# EAGLE design WiFly_Shield (EAGLE 5.11)
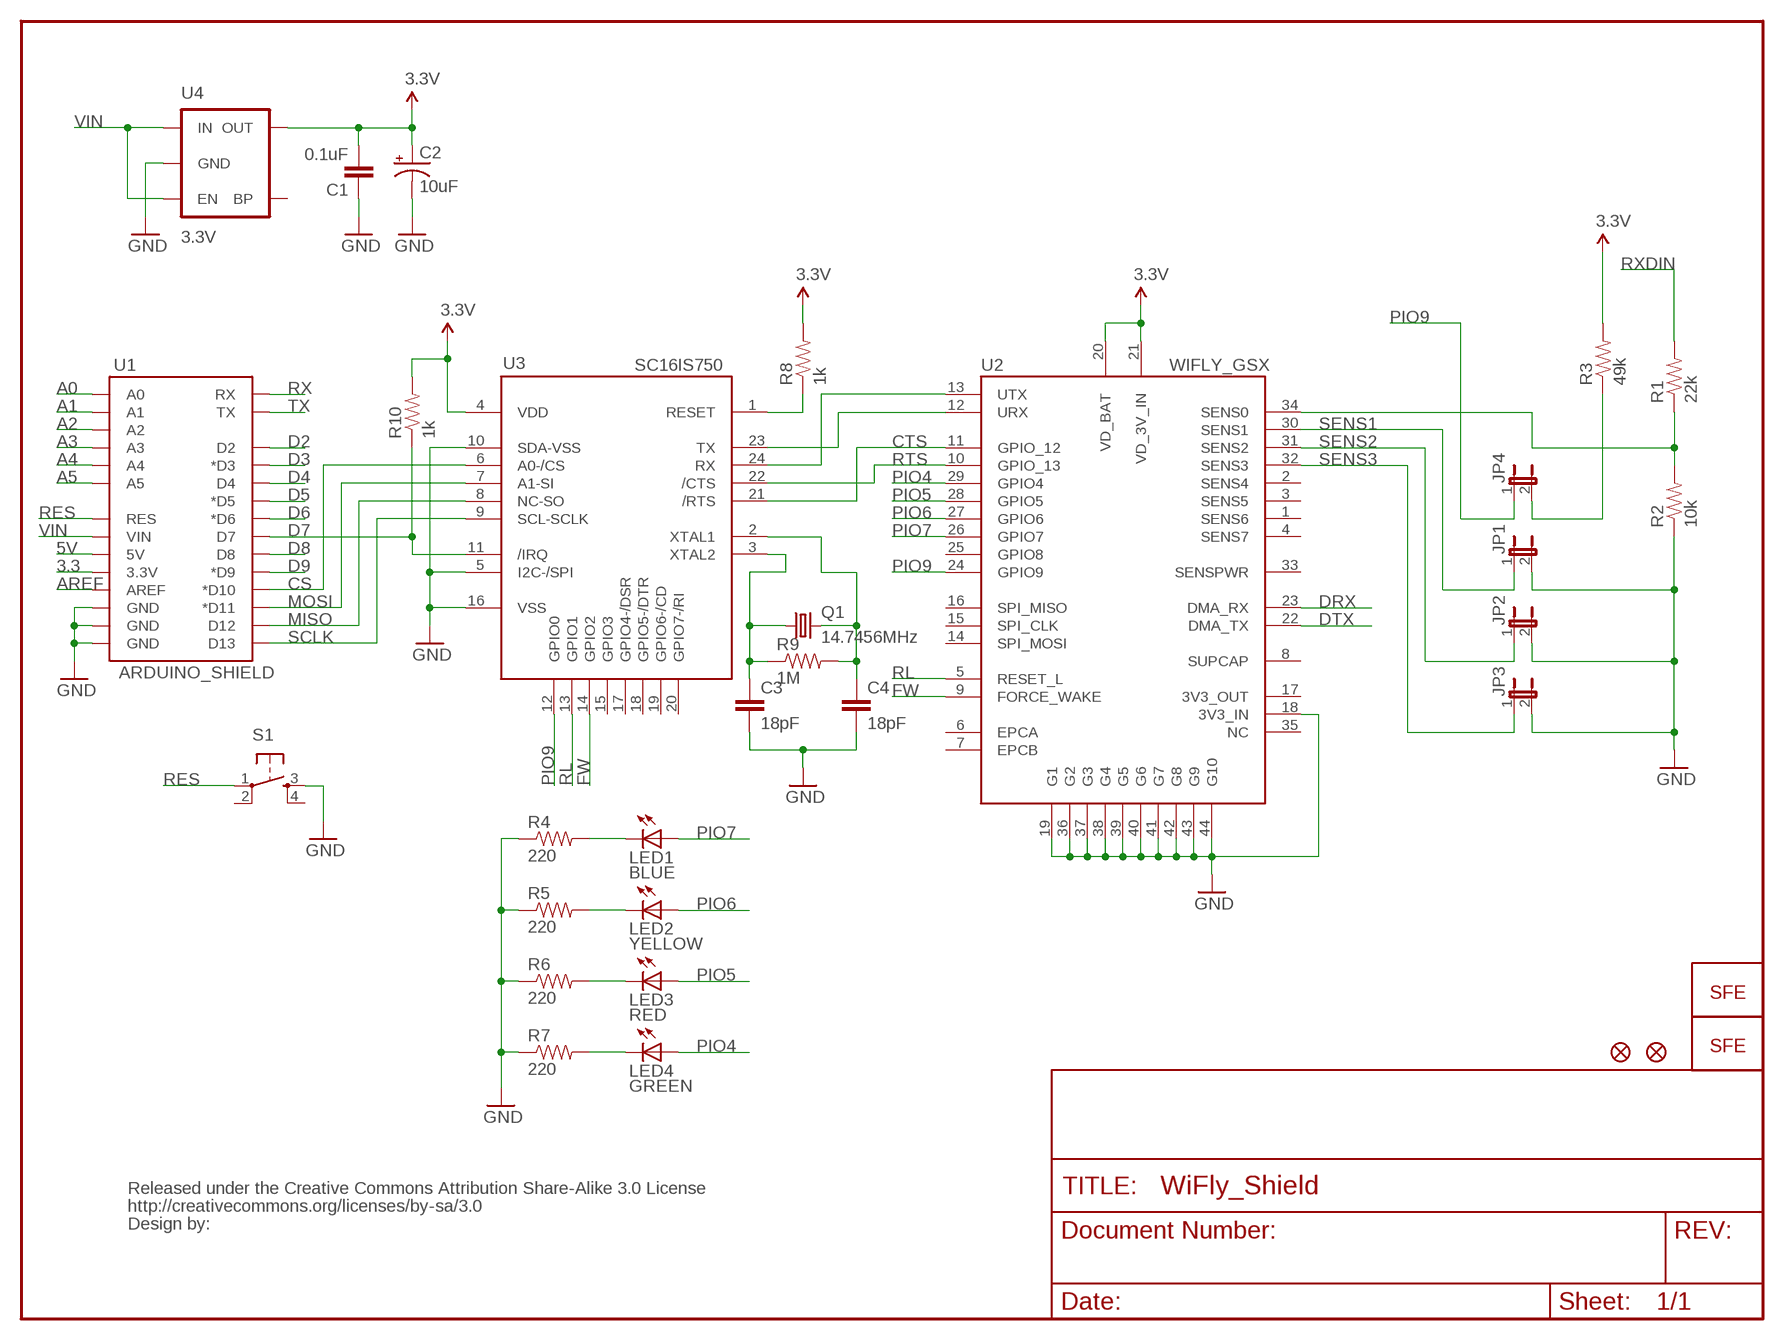
[diagram p0: schematic, sheet 1]

## Parts
C1  0.1uF  CAP0402-CAP  [0402-CAP]
C2  10uF  CAP_POL1206  [EIA3216]
C3  18pF  CAP0402-CAP  [0402-CAP]
C4  18pF  CAP0402-CAP  [0402-CAP]
JP1  JUMPER-2SMD-NO  [SJ_2S-NO]
JP2  JUMPER-2SMD-NO  [SJ_2S-NO]
JP3  JUMPER-2SMD-NO  [SJ_2S-NO]
JP4  JUMPER-2SMD-NO  [SJ_2S-NO]
JP6  LOGO-SFENEW  [SFE-NEW-WEBLOGO]
JP7  FIDUCIAL1X2  [FIDUCIAL-1X2]
JP8  FIDUCIAL1X2  [FIDUCIAL-1X2]
JP9  LOGO-SFESK  [SFE-LOGO-FLAME]
LED1  BLUE  LED0603  [LED-0603]
LED2  YELLOW  LED0603  [LED-0603]
LED3  RED  LED0603  [LED-0603]
LED4  GREEN  LED0603  [LED-0603]
Q1  14.7456MHz  CRYSTAL5X3  [CRYSTAL-SMD-5X3]
R1  22k  RESISTOR0402-RES  [0402-RES]
R2  10k  RESISTOR0402-RES  [0402-RES]
R3  49k  RESISTOR0402-RES  [0402-RES]
R4  220  RESISTOR0402-RES  [0402-RES]
R5  220  RESISTOR0402-RES  [0402-RES]
R6  220  RESISTOR0402-RES  [0402-RES]
R7  220  RESISTOR0402-RES  [0402-RES]
R8  1k  RESISTOR0402-RES  [0402-RES]
R9  1M  RESISTOR0402-RES  [0402-RES]
R10  1k  RESISTOR0402-RES  [0402-RES]
S1  TAC_SWITCHSMD  [TACTILE_SWITCH_SMD]
U1  ARDUINO_SHIELD  ARDUINO_SHIELDLABEL  [DUEMILANOVE_SHIELD]
U2  WIFLY_GSX  [WIFLY_GSX]
U3  SC16IS750  [QFN-24]
U4  3.3V  V_REG_LDOSMD  [SOT23-5]
U$1  CREATIVE_COMMONS  [CREATIVE_COMMONS]

## Nets
3.3: U1.3.3V
3.3V: C1.2 C2.A(+) R3.2 R8.2 R10.2 U2.20(VD_BAT) U2.21(VD_3V_IN) U3.4(VDD) U4.5(OUT)
5V: U1.5V
A0: U1.A0
A1: U1.A1
A2: U1.A2
A3: U1.A3
A4: U1.A4
A5: U1.A5
AREF: U1.AREF
CS: U1.D10(*D10) U3.6(A0-/CS)
CTS: U2.11(GPIO_12) U3.21(/RTS)
D2: U1.D2
D3: U1.D3(*D3)
D4: U1.D4
D5: U1.D5(*D5)
D6: U1.D6(*D6)
D7: R10.1 U1.D7 U3.11(/IRQ)
D8: U1.D8
D9: U1.D9(*D9)
DRX: U2.23(DMA_RX)
DTX: U2.22(DMA_TX)
FW: U2.9(FORCE_WAKE) U3.14(GPIO2)
GND: C1.1 C2.C(-) C3.2 C4.2 JP1.2 JP2.2 JP3.2 R2.1 R4.1 R5.1 R6.1 R7.1 S1.3 U1.GND@0(GND) U1.GND@1(GND) U1.GND@2(GND) U2.18(3V3_IN) U2.19(G1) U2.36(G2) U2.37(G3) U2.38(G4) U2.39(G5) U2.40(G6) U2.41(G7) U2.42(G8) U2.43(G9) U2.44(G10) U3.5(I2C-/SPI) U3.10(SDA-VSS) U3.16(VSS) U4.2(GND)
MISO: U1.D12 U3.8(NC-SO)
MOSI: U1.D11(*D11) U3.7(A1-SI)
N$1: LED4.C R7.2
N$2: JP4.2 R3.1
N$3: LED3.C R6.2
N$4: LED2.C R5.2
N$5: LED1.C R4.2
N$6: U2.13(UTX) U3.24(RX)
N$7: U2.12(URX) U3.23(TX)
N$9: R8.1 U3.1(RESET)
N$11: C3.1 Q1.1 R9.1 U3.3(XTAL2)
N$12: C4.1 Q1.3 R9.2 U3.2(XTAL1)
N$16: R1.1 R2.2 U2.34(SENS0)
PIO4: LED4.A U2.29(GPIO4)
PIO5: LED3.A U2.28(GPIO5)
PIO6: LED2.A U2.27(GPIO6)
PIO7: LED1.A U2.26(GPIO7)
PIO9: JP4.1 U2.24(GPIO9) U3.12(GPIO0)
RES: S1.1 U1.RES
RL: U2.5(RESET_L) U3.13(GPIO1)
RTS: U2.10(GPIO_13) U3.22(/CTS)
RX: U1.RX
RXDIN: R1.2
SCLK: U1.D13 U3.9(SCL-SCLK)
SENS1: JP1.1 U2.30(SENS1)
SENS2: JP2.1 U2.31(SENS2)
SENS3: JP3.1 U2.32(SENS3)
TX: U1.TX
VIN: U1.VIN U4.1(IN) U4.3(EN)
Unconnected: S1.2 S1.4 U2.1(SENS6) U2.2(SENS4) U2.3(SENS5) U2.4(SENS7) U2.6(EPCA) U2.7(EPCB) U2.8(SUPCAP) U2.14(SPI_MOSI) U2.15(SPI_CLK) U2.16(SPI_MISO) U2.17(3V3_OUT) U2.25(GPIO8) U2.33(SENSPWR) U2.35(NC) U3.15(GPIO3) U3.17(GPIO4-/DSR) U3.18(GPIO5-/DTR) U3.19(GPIO6-/CD) U3.20(GPIO7-/RI) U4.4(BP)

## Library data of the parts
C1 C3 C4 = SparkFun:CAP: Capacitor Standard 0603 ceramic capacitor, and 0.1" leaded capacitor.
C2 = SparkFun:CAP_POL: Capacitor Polarized These are standard SMD and PTH capacitors. Normally 10uF, 47uF, and 100uF in electrolytic and tantalum varieties. Always verify the external diameter of the through hole cap, it varies with capacity, voltage, and manufacturer. The EIA devices should be standard.
JP1-JP4 = SparkFun:JUMPER-2: Jumper Basic 0.1" spaced jumper. Use with breakaway headers.
JP6 JP9 = SparkFun:LOGO-SFE: Spark Fun Electronics PCB Logo This is the standard Spark Fun Electronics PCB logo.
JP7 JP8 = SparkFun:FIDUCIAL: Fiducial Alignment Points Various fiducial points for machine vision alignment.
LED1-LED4 = SparkFun:LED: LEDs Standard schematic elements and footprints for 5mm, 3mm, 1206, and 0603 sized LEDs. 5mm - Spark Fun Electronics SKU : COM-00529 (and others)
Q1 = SparkFun:CRYSTAL: Crystals Various standard crystals. Proven footprints. Spark Fun Electronics SKU : COM-00534
R1-R10 = SparkFun:RESISTOR: Resistor Basic schematic elements and footprints for 0603, 1206, and PTH 1/10th watt (small) resistors.
S1 = SparkFun:TAC_SWITCH: Momentary Switch Button commonly used for reset or general input. Spark Fun Electronics SKU : COM-00097
U1 = SparkFun:ARDUINO_SHIELD
U2 = SparkFun:WIFLY_GSX
U3 = SparkFun:SC16IS750
U4 = SparkFun:V_REG_LDO: Voltage Regulator LDO Standard 150mA LDO voltage regulator in SOT-23 layout. Micrel part MIC5205. BP (by-pass) pin is used to lower output noise with 470pF cap.
U$1 = SparkFun:CREATIVE_COMMONS

## Board
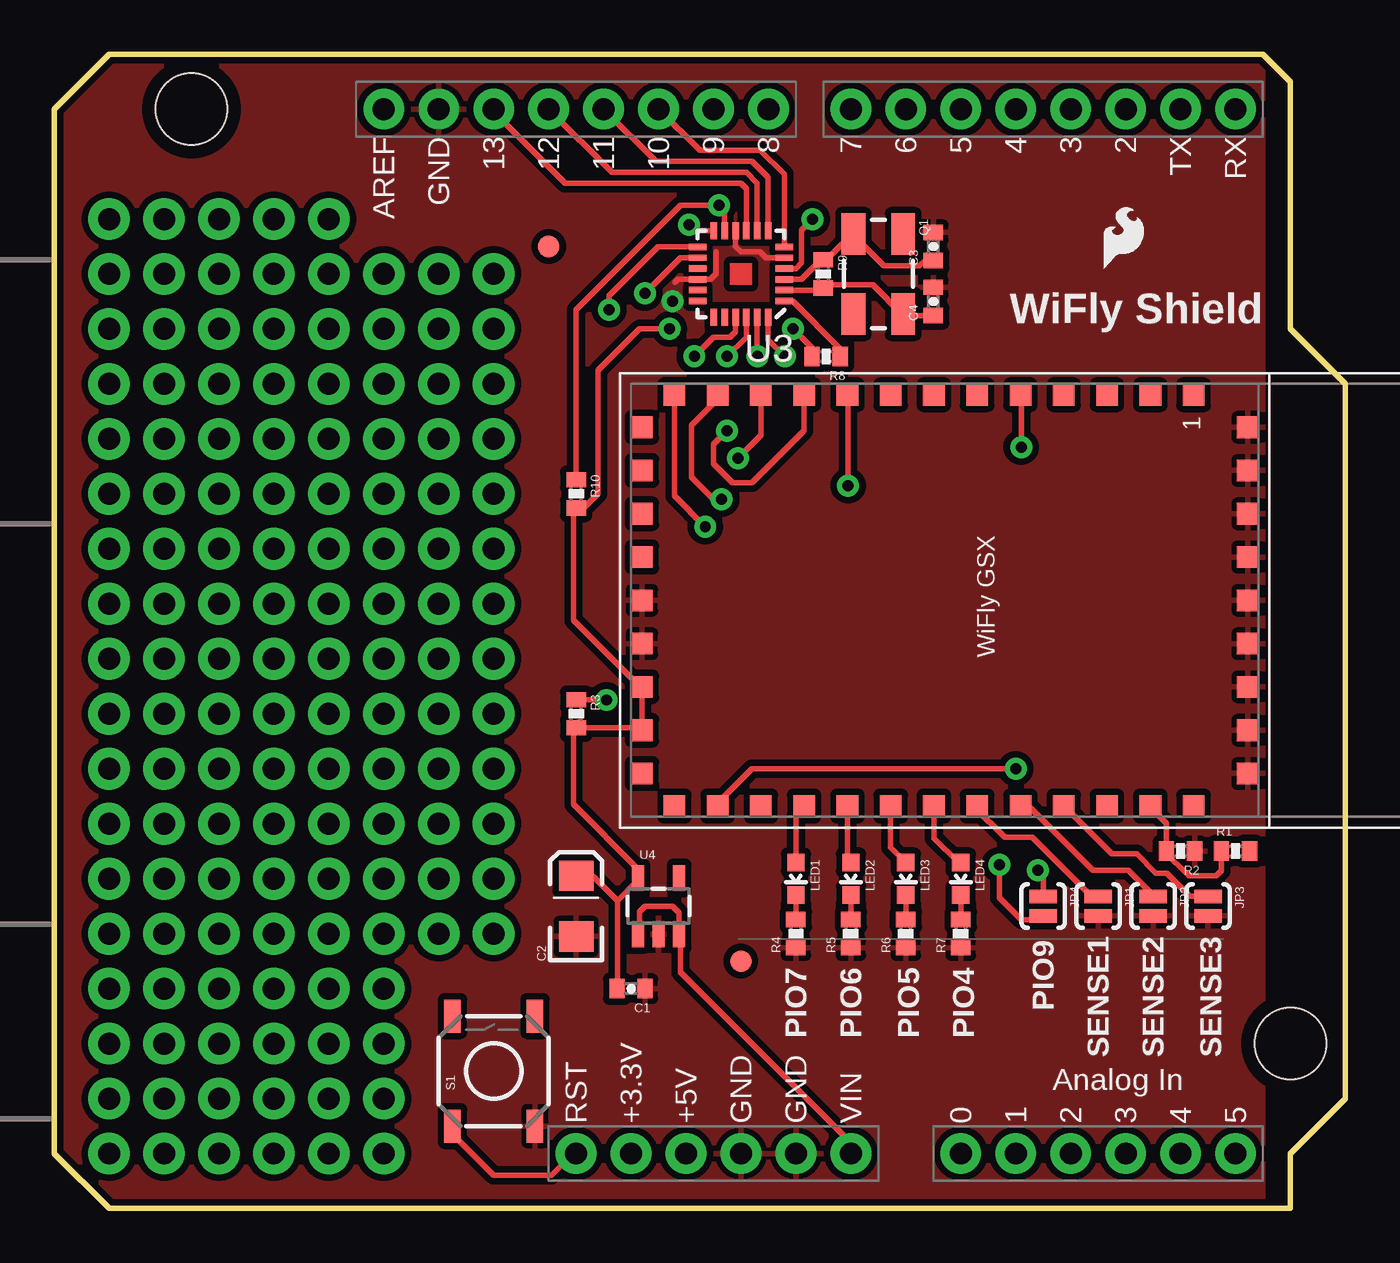
[diagram p1: board, top side]
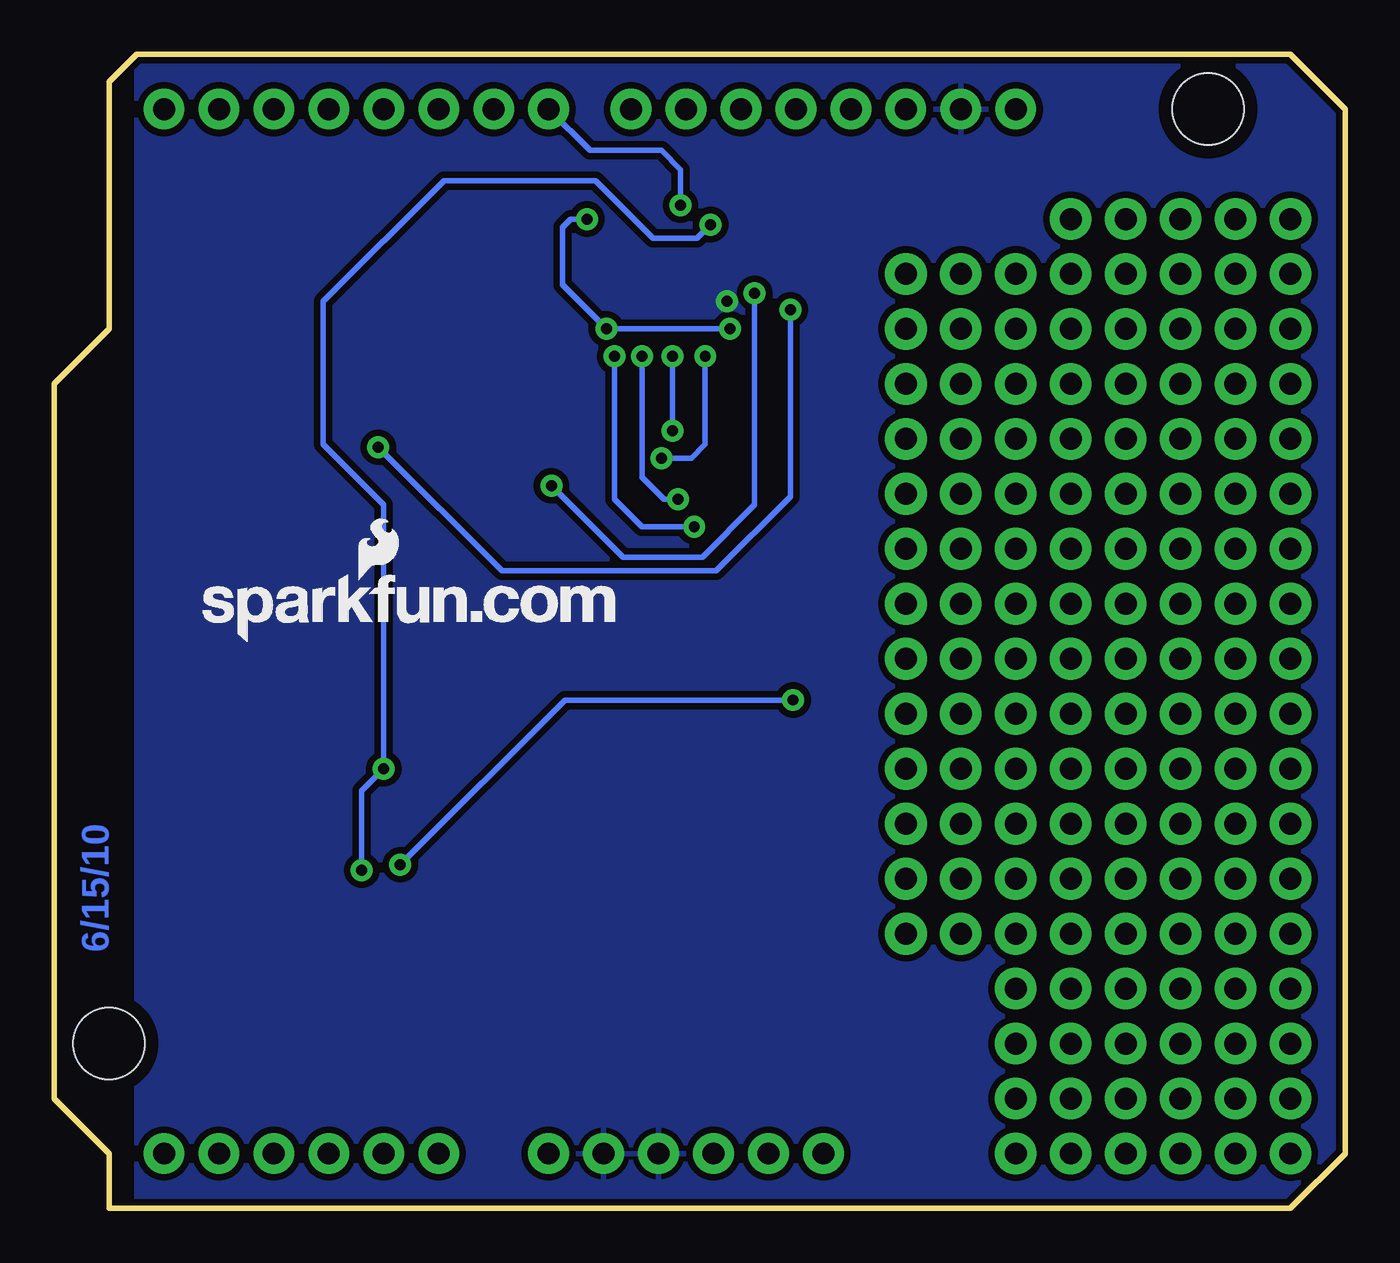
[diagram p2: board, bottom side, seen from below]

Size 59.69 x 53.34 mm. Coordinates in mm from the lower left corner, seen from the top.
Outline: 2.54,53.34 55.88,53.34 57.15,52.07 57.15,40.64 59.69,38.1 59.69,5.08 57.15,2.54 57.15,0 2.54,0 0,2.54 0,50.8 2.54,53.34
Copper layers (1*16): Top 0.035mm / dielectric 1.5mm / Bottom 0.035mm
Design rules "SparkFun *": minimum track width 8mil, minimum drill 20mil, track to track 8mil, track to pad 8mil, pad to pad 7mil, via to via 8mil, smd to smd 8mil, copper to edge 10mil, drill to drill 8mil, minimum pad ring 12mil, minimum via ring 10mil, stop-mask expansion 4mil, vias tented up to drill 25mil, thermal gap 10mil

### Footprints (pad centres in the part's own frame; a part is rotated, then mirrored left to right if it is on the bottom)
0402-CAP = smd 0.7 x 0.9: 1 -0.65,0; 2 0.65,0
EIA3216 = smd 1.4 x 1.6: A 1.4,0; C -1.4,0
SJ_2S-NO = smd 0.635 x 1.27: 1 -0.45,0; 2 0.45,0
FIDUCIAL-1X2 = smd 1 x 1: 1 0,0
LED-0603 = smd 0.8 x 0.8: A 0,-0.75; C 0,0.75
CRYSTAL-SMD-5X3 = smd 1.9 x 1.1: 1 -1.85,-1.15; 2 1.85,-1.15; 3 1.85,1.15; 4 -1.85,1.15
0402-RES = smd 0.7 x 0.9: 1 -0.65,0; 2 0.65,0
TACTILE_SWITCH_SMD = smd 1.524 x 0.762: 1 -2.54,1.905; 2 2.54,1.905; 3 -2.54,-1.905; 4 2.54,-1.905
DUEMILANOVE_SHIELD = drill 1.016 pad 1.88 round: 3.3V 50.8,26.67; 5V 50.8,29.21; A0 50.8,41.91; A1 50.8,44.45; A2 50.8,46.99; A3 50.8,49.53; A4 50.8,52.07; A5 50.8,54.61; AREF 2.54,15.24; D2 2.54,49.53; D3 2.54,46.99; D4 2.54,44.45; D5 2.54,41.91; D6 2.54,39.37; D7 2.54,36.83; D8 2.54,33.02; D9 2.54,30.48; D10 2.54,27.94; D11 2.54,25.4; D12 2.54,22.86; D13 2.54,20.32; GND@0 50.8,31.75; GND@1 50.8,34.29; GND@2 2.54,17.78; RES 50.8,24.13; RX 2.54,54.61; TX 2.54,52.07; VIN 50.8,36.83 | hole 3.302: 45.72,57.15; 2.54,6.35
WIFLY_GSX = smd 1 x 1: 1 0.5,26; 2 0.5,24; 3 0.5,22; 4 0.5,20; 5 0.5,18; 6 0.5,16; 7 0.5,14; 8 0.5,12; 9 0.5,10; 10 0.5,8; 11 0.5,6; 12 0.5,4; 13 0.5,2; 14 2,0.5; 15 4,0.5; 16 6,0.5; 17 8,0.5; 18 10,0.5; 19 12,0.5; 20 14,0.5; 21 16,0.5; 22 18,0.5; 23 19.5,2; 24 19.5,4; 25 19.5,6; 26 19.5,8; 27 19.5,10; 28 19.5,12; 29 19.5,14; 30 19.5,16; 31 19.5,18; 32 19.5,20; 33 19.5,22; 34 19.5,24; 35 19.5,26; 36 18,28.5; 37 16,28.5; 38 14,28.5; 39 12,28.5; 40 10,28.5; 41 8,28.5; 42 6,28.5; 43 4,28.5; 44 2,28.5
QFN-24 = smd 0.8 x 0.3: 1 -2,1.25; 2 -2,0.75; 3 -2,0.25; 4 -2,-0.25; 5 -2,-0.75; 6 -2,-1.25; 13 2,-1.25; 14 2,-0.75; 15 2,-0.25; 16 2,0.25; 17 2,0.75; 18 2,1.25 | smd 0.3 x 0.8: 7 -1.25,-2; 8 -0.75,-2; 9 -0.25,-2; 10 0.25,-2; 11 0.75,-2; 12 1.25,-2; 19 1.25,2; 20 0.75,2; 21 0.25,2; 22 -0.25,2; 23 -0.75,2; 24 -1.25,2
SOT23-5 = smd 0.55 x 1.2: 1 -0.95,-1.3; 2 0,-1.3; 3 0.95,-1.3; 4 0.95,1.3; 5 -0.95,1.3

### Placement (x,y rotation side)
C1  26.67,10.16 180 top
C2  24.13,13.97 90 top
C3  40.64,44.45 90 top
C4  40.64,41.91 90 top
JP1  48.26,13.97 270 top
JP2  50.8,13.97 270 top
JP3  53.34,13.97 270 top
JP4  45.72,13.97 270 top
JP6  52.83,26.16 0 bottom
JP7  31.75,11.43 0 top
JP8  22.86,44.45 0 top
JP9  48.51,43.43 0 top
LED1  34.29,15.24 180 top
LED2  36.83,15.24 180 top
LED3  39.37,15.24 180 top
LED4  41.91,15.24 180 top
Q1  38.1,43.18 270 top
R1  54.61,16.51 0 top
R2  52.07,16.51 180 top
R3  24.13,22.86 270 top
R4  34.29,12.7 90 top
R5  36.83,12.7 90 top
R6  39.37,12.7 90 top
R7  41.91,12.7 90 top
R8  35.69,39.37 180 top
R9  35.56,43.18 270 top
R10  24.13,33.02 270 top
S1  20.32,6.35 90 top
U1  0,53.34 270 top
U2  26.67,38.1 270 top
U3  31.75,43.18 180 top
U4  27.94,13.97 0 top
U$1  5.08,-8.89 0 top  (outside the outline)

### Tracks (layer width: path | path; a pad name or v marks a point on that pad's centre or on a via)
3.3V  (via drill 0.51)
  Top 0.254: 27.11,22.16 27.07,22.21 24.37,22.21 24.26,22.1 24.14,22.21 R3.2 24.13,22.1 24,22.1 | 27.11,22.16 U2.21 | 24,22.1 24,18.67 26.99,15.68 26.99,15.31 26.95,15.27 | 24,22.1 24,22.23 24.26,22.48 | 27.3,22.1 | 27.3,22.1 U2.21 27.17,22.22 | 27.18,22.23 27.3,22.1 | 27.18,22.23 27.17,22.23 U2.20 27.17,24.12 | v34.16,40.64 35.04,39.77 35.04,39.38 35.05,39.37 R8.2 | v35.05,45.72 34.54,45.21 34.54,43.69 34.29,43.43 33.79,43.43 33.78,43.43 U3.4 | 24.14,32.37 24.13,32.38 24,32.26 24,27.18 27.08,24.1 27.15,24.1 27.17,24.12 | 24.14,32.37 24.5,32.37 25.15,33.02 25.15,38.73 27.05,40.64 v28.45,40.64 | 27.17,24.12 27.18,24.13 | C1.2 26.04,10.18 26.04,14.22 | 26.92,15.24 26.96,15.24 U4.5 26.95,15.27 | 26.04,14.22 26.92,15.11 26.92,15.24 | C2.A 24.89,15.37 26.04,14.22 | 26.92,15.24 26.95,15.27 | 27.11,22.16 27.17,22.22 | 27.17,22.22 27.18,22.23 | R10.2 24.13,32.26 24.14,32.27 24.14,32.37
  Bottom 0.254: v35.05,45.72 35.81,45.72 36.2,45.34 36.2,42.67 v34.16,40.64 v28.45,40.64
CS
  Top 0.254: U1.D10 29.84,48.9 32.64,48.9 33.75,47.78 U3.6
CTS  (via drill 0.51)
  Top 0.254: U3.21 31.5,40.52 31.24,40.26 30.48,40.26 v29.59,39.37 | U2.11 32.67,35.72 v31.62,34.67
  Bottom 0.254: v31.62,34.67 30.23,34.67 29.59,35.31 v29.59,39.37
D7  (via drill 0.51)
  Top 0.254: U3.11 31,46.09 v30.73,46.35 28.96,46.35 24.13,41.53 R10.1
  Bottom 0.254: v30.73,46.35 30.73,48.01 31.62,48.9 34.92,48.9 U1.D7
FW  (via drill 0.51)
  Top 0.254: U3.14 28.94,43.93 v27.3,42.29 | v36.7,33.4 36.7,37.57 U2.9
  Bottom 0.254: v27.3,42.29 27.3,32.51 29.72,30.1 33.4,30.1 v36.7,33.4
GND  (via drill 0.51)
  Top 0.254: 30.61,44.2 30.61,43.18 30.35,42.93 29.84,42.93 U3.16 28.83,42.93 28.7,42.8 | U3.5 32.91,43.93 32.64,44.2 31.75,44.2 31.5,44.45 U3.10
  other vias: 28.57,41.91
  pour Bottom (isolate 0.305): 2.54,53.34 55.88,53.34 55.88,0 2.54,0 0,2.54 0,50.8
  pour Top (isolate 0.305): 2.54,53.34 55.88,53.34 55.88,0 2.54,0 0,2.54 0,50.8
MISO
  Top 0.254: U3.8 32.5,47.38 32,47.88 25.78,47.88 U1.D12
MOSI
  Top 0.254: U3.7 33,47.65 32.26,48.39 27.81,48.39 U1.D11
N$1
  Top 0.254: 41.91,14.61 LED4.C R7.2
N$2  (via drill 0.51)
  Top 0.254: R3.1 25.51,23.51 v25.53,23.5 | v43.69,15.88 43.69,14.35 44.7,13.34 45.47,13.34 45.65,13.52 JP4.2
  Bottom 0.254: v25.53,23.5 36.07,23.5 v43.69,15.88
N$3
  Top 0.254: 39.37,14.61 LED3.C R6.2
N$4
  Top 0.254: 36.83,14.61 LED2.C R5.2
N$5
  Top 0.254: R4.2 LED1.C
N$6  (via drill 0.51)
  Top 0.254: U3.24 33,40.15 v33.78,39.37 | U2.13 28.67,32.92 v30.1,31.5
  Bottom 0.254: v30.1,31.5 32.51,31.5 33.78,32.77 v33.78,39.37
N$7  (via drill 0.51)
  Top 0.254: U3.23 32.5,39.89 v32.51,39.37 | U2.12 30.67,37.4 29.46,36.2 29.46,33.78 30.48,32.77 v30.86,32.77
  Bottom 0.254: v30.86,32.77 31.5,32.77 32.51,33.78 v32.51,39.37
N$9
  Top 0.254: R8.1 36.34,39.74 34.14,41.93 U3.1
N$11
  Top 0.254: C3.1 40.24,43.8 40.01,43.56 38.35,43.56 36.95,44.97 | 36.95,44.97 Q1.1 | 36.95,44.97 36.84,44.97 35.69,43.81 35.67,43.83 R9.1 35.45,43.83 34.55,42.93 U3.3
N$12
  Top 0.254: C4.1 39.38,41.26 39.31,41.33 Q1.3 39.19,41.33 37.85,42.67 35.81,42.67 35.56,42.42 R9.2 35.56,42.55 35.45,42.43 U3.2
N$15  (via drill 1.02 pad 1.93)
  other vias: 5.08,2.54
N$16
  Top 0.254: U2.34 50.67,18.55 51.42,17.8 R2.2 51.31,16.51 52.45,15.37 53.72,15.37 53.96,15.61 R1.1
N$17  (via drill 1.02 pad 1.93)
  other vias: 7.62,2.54
N$18  (via drill 1.02 pad 1.93)
  other vias: 10.16,2.54
N$19  (via drill 1.02 pad 1.93)
  other vias: 12.7,2.54
N$20  (via drill 1.02 pad 1.93)
  other vias: 15.24,2.54
N$23  (via drill 1.02 pad 1.93)
  other vias: 2.54,2.54
N$24  (via drill 1.02 pad 1.93)
  other vias: 5.08,5.08
N$25  (via drill 1.02 pad 1.93)
  other vias: 7.62,5.08
N$26  (via drill 1.02 pad 1.93)
  other vias: 10.16,5.08
N$27  (via drill 1.02 pad 1.93)
  other vias: 12.7,5.08
N$28  (via drill 1.02 pad 1.93)
  other vias: 15.24,5.08
N$31  (via drill 1.02 pad 1.93)
  other vias: 2.54,5.08
N$32  (via drill 1.02 pad 1.93)
  other vias: 5.08,7.62
N$33  (via drill 1.02 pad 1.93)
  other vias: 7.62,7.62
N$34  (via drill 1.02 pad 1.93)
  other vias: 10.16,7.62
N$35  (via drill 1.02 pad 1.93)
  other vias: 12.7,7.62
N$36  (via drill 1.02 pad 1.93)
  other vias: 15.24,7.62
N$39  (via drill 1.02 pad 1.93)
  other vias: 2.54,7.62
N$40  (via drill 1.02 pad 1.93)
  other vias: 5.08,10.16
N$41  (via drill 1.02 pad 1.93)
  other vias: 7.62,10.16
N$42  (via drill 1.02 pad 1.93)
  other vias: 10.16,10.16
N$43  (via drill 1.02 pad 1.93)
  other vias: 12.7,10.16
N$44  (via drill 1.02 pad 1.93)
  other vias: 15.24,10.16
N$47  (via drill 1.02 pad 1.93)
  other vias: 2.54,10.16
N$48  (via drill 1.02 pad 1.93)
  other vias: 5.08,12.7
N$49  (via drill 1.02 pad 1.93)
  other vias: 7.62,12.7
N$50  (via drill 1.02 pad 1.93)
  other vias: 10.16,12.7
N$51  (via drill 1.02 pad 1.93)
  other vias: 12.7,12.7
N$52  (via drill 1.02 pad 1.93)
  other vias: 15.24,12.7
N$53  (via drill 1.02 pad 1.93)
  other vias: 17.78,12.7
N$54  (via drill 1.02 pad 1.93)
  other vias: 20.32,12.7
N$55  (via drill 1.02 pad 1.93)
  other vias: 2.54,12.7
N$56  (via drill 1.02 pad 1.93)
  other vias: 5.08,15.24
N$57  (via drill 1.02 pad 1.93)
  other vias: 7.62,15.24
N$58  (via drill 1.02 pad 1.93)
  other vias: 10.16,15.24
N$59  (via drill 1.02 pad 1.93)
  other vias: 12.7,15.24
N$60  (via drill 1.02 pad 1.93)
  other vias: 15.24,15.24
N$61  (via drill 1.02 pad 1.93)
  other vias: 17.78,15.24
N$62  (via drill 1.02 pad 1.93)
  other vias: 20.32,15.24
N$63  (via drill 1.02 pad 1.93)
  other vias: 2.54,15.24
N$64  (via drill 1.02 pad 1.93)
  other vias: 5.08,17.78
N$65  (via drill 1.02 pad 1.93)
  other vias: 7.62,17.78
N$66  (via drill 1.02 pad 1.93)
  other vias: 10.16,17.78
N$67  (via drill 1.02 pad 1.93)
  other vias: 12.7,17.78
N$68  (via drill 1.02 pad 1.93)
  other vias: 15.24,17.78
N$69  (via drill 1.02 pad 1.93)
  other vias: 17.78,17.78
N$70  (via drill 1.02 pad 1.93)
  other vias: 20.32,17.78
N$71  (via drill 1.02 pad 1.93)
  other vias: 2.54,17.78
N$72  (via drill 1.02 pad 1.93)
  other vias: 5.08,20.32
N$73  (via drill 1.02 pad 1.93)
  other vias: 7.62,20.32
N$74  (via drill 1.02 pad 1.93)
  other vias: 10.16,20.32
N$75  (via drill 1.02 pad 1.93)
  other vias: 12.7,20.32
N$76  (via drill 1.02 pad 1.93)
  other vias: 15.24,20.32
N$77  (via drill 1.02 pad 1.93)
  other vias: 17.78,20.32
N$78  (via drill 1.02 pad 1.93)
  other vias: 20.32,20.32
N$79  (via drill 1.02 pad 1.93)
  other vias: 2.54,20.32
N$80  (via drill 1.02 pad 1.93)
  other vias: 5.08,22.86
N$81  (via drill 1.02 pad 1.93)
  other vias: 7.62,22.86
N$82  (via drill 1.02 pad 1.93)
  other vias: 10.16,22.86
N$83  (via drill 1.02 pad 1.93)
  other vias: 12.7,22.86
N$84  (via drill 1.02 pad 1.93)
  other vias: 15.24,22.86
N$85  (via drill 1.02 pad 1.93)
  other vias: 17.78,22.86
N$86  (via drill 1.02 pad 1.93)
  other vias: 20.32,22.86
N$87  (via drill 1.02 pad 1.93)
  other vias: 2.54,22.86
N$88  (via drill 1.02 pad 1.93)
  other vias: 5.08,25.4
N$89  (via drill 1.02 pad 1.93)
  other vias: 7.62,25.4
N$90  (via drill 1.02 pad 1.93)
  other vias: 10.16,25.4
N$91  (via drill 1.02 pad 1.93)
  other vias: 12.7,25.4
N$92  (via drill 1.02 pad 1.93)
  other vias: 15.24,25.4
N$93  (via drill 1.02 pad 1.93)
  other vias: 17.78,25.4
N$94  (via drill 1.02 pad 1.93)
  other vias: 20.32,25.4
N$95  (via drill 1.02 pad 1.93)
  other vias: 2.54,25.4
N$96  (via drill 1.02 pad 1.93)
  other vias: 5.08,27.94
N$97  (via drill 1.02 pad 1.93)
  other vias: 7.62,27.94
N$98  (via drill 1.02 pad 1.93)
  other vias: 10.16,27.94
N$99  (via drill 1.02 pad 1.93)
  other vias: 12.7,27.94
N$100  (via drill 1.02 pad 1.93)
  other vias: 15.24,27.94
N$101  (via drill 1.02 pad 1.93)
  other vias: 17.78,27.94
N$102  (via drill 1.02 pad 1.93)
  other vias: 20.32,27.94
N$103  (via drill 1.02 pad 1.93)
  other vias: 2.54,27.94
N$104  (via drill 1.02 pad 1.93)
  other vias: 5.08,30.48
N$105  (via drill 1.02 pad 1.93)
  other vias: 7.62,30.48
N$106  (via drill 1.02 pad 1.93)
  other vias: 10.16,30.48
N$107  (via drill 1.02 pad 1.93)
  other vias: 12.7,30.48
N$108  (via drill 1.02 pad 1.93)
  other vias: 15.24,30.48
N$109  (via drill 1.02 pad 1.93)
  other vias: 17.78,30.48
N$110  (via drill 1.02 pad 1.93)
  other vias: 20.32,30.48
N$111  (via drill 1.02 pad 1.93)
  other vias: 2.54,30.48
N$112  (via drill 1.02 pad 1.93)
  other vias: 5.08,33.02
N$113  (via drill 1.02 pad 1.93)
  other vias: 7.62,33.02
N$114  (via drill 1.02 pad 1.93)
  other vias: 10.16,33.02
N$115  (via drill 1.02 pad 1.93)
  other vias: 12.7,33.02
N$116  (via drill 1.02 pad 1.93)
  other vias: 15.24,33.02
N$117  (via drill 1.02 pad 1.93)
  other vias: 17.78,33.02
N$118  (via drill 1.02 pad 1.93)
  other vias: 20.32,33.02
N$119  (via drill 1.02 pad 1.93)
  other vias: 2.54,33.02
N$120  (via drill 1.02 pad 1.93)
  other vias: 5.08,35.56
N$121  (via drill 1.02 pad 1.93)
  other vias: 7.62,35.56
N$122  (via drill 1.02 pad 1.93)
  other vias: 10.16,35.56
N$123  (via drill 1.02 pad 1.93)
  other vias: 12.7,35.56
N$124  (via drill 1.02 pad 1.93)
  other vias: 15.24,35.56
N$125  (via drill 1.02 pad 1.93)
  other vias: 17.78,35.56
N$126  (via drill 1.02 pad 1.93)
  other vias: 20.32,35.56
N$127  (via drill 1.02 pad 1.93)
  other vias: 2.54,35.56
N$128  (via drill 1.02 pad 1.93)
  other vias: 5.08,38.1
N$129  (via drill 1.02 pad 1.93)
  other vias: 7.62,38.1
N$130  (via drill 1.02 pad 1.93)
  other vias: 10.16,38.1
N$131  (via drill 1.02 pad 1.93)
  other vias: 12.7,38.1
N$132  (via drill 1.02 pad 1.93)
  other vias: 15.24,38.1
N$133  (via drill 1.02 pad 1.93)
  other vias: 17.78,38.1
N$134  (via drill 1.02 pad 1.93)
  other vias: 20.32,38.1
N$135  (via drill 1.02 pad 1.93)
  other vias: 2.54,38.1
N$136  (via drill 1.02 pad 1.93)
  other vias: 5.08,40.64
N$137  (via drill 1.02 pad 1.93)
  other vias: 7.62,40.64
N$138  (via drill 1.02 pad 1.93)
  other vias: 10.16,40.64
N$139  (via drill 1.02 pad 1.93)
  other vias: 12.7,40.64
N$140  (via drill 1.02 pad 1.93)
  other vias: 15.24,40.64
N$141  (via drill 1.02 pad 1.93)
  other vias: 17.78,40.64
N$142  (via drill 1.02 pad 1.93)
  other vias: 20.32,40.64
N$143  (via drill 1.02 pad 1.93)
  other vias: 2.54,40.64
N$144  (via drill 1.02 pad 1.93)
  other vias: 5.08,43.18
N$145  (via drill 1.02 pad 1.93)
  other vias: 7.62,43.18
N$146  (via drill 1.02 pad 1.93)
  other vias: 10.16,43.18
N$147  (via drill 1.02 pad 1.93)
  other vias: 12.7,43.18
N$148  (via drill 1.02 pad 1.93)
  other vias: 15.24,43.18
N$149  (via drill 1.02 pad 1.93)
  other vias: 17.78,43.18
N$150  (via drill 1.02 pad 1.93)
  other vias: 20.32,43.18
N$151  (via drill 1.02 pad 1.93)
  other vias: 2.54,43.18
N$152  (via drill 1.02 pad 1.93)
  other vias: 5.08,45.72
N$153  (via drill 1.02 pad 1.93)
  other vias: 7.62,45.72
N$155  (via drill 1.02 pad 1.93)
  other vias: 10.16,45.72
N$156  (via drill 1.02 pad 1.93)
  other vias: 12.7,45.72
N$160  (via drill 1.02 pad 1.93)
  other vias: 2.54,45.72
PIO4
  Top 0.254: LED4.A 41.8,15.99 40.67,17.11 U2.29
PIO5
  Top 0.254: LED3.A 39.37,16 38.67,16.7 U2.28
PIO6
  Top 0.254: LED2.A 36.95,15.99 36.96,16 36.67,16.29 U2.27
PIO7
  Top 0.254: U2.26 34.67,18.54 34.29,18.16 LED1.A
PIO9  (via drill 0.51)
  Top 0.254: JP4.1 45.72,15.37 v45.47,15.62 | U2.24 30.67,18.73 32.26,20.32 43.18,20.32 v44.45,20.32 | U3.12 29.62,45.18 v29.34,45.47
  Bottom 0.254: v45.47,15.62 45.47,19.3 v44.45,20.32 44.45,32.51 47.24,35.31 47.24,41.91 41.66,47.5 34.67,47.5 32,44.83 29.97,44.83 v29.34,45.47
RES
  Top 0.254: U1.RES 24,2.54 22.99,1.52 20.32,1.52 18.41,3.43 S1.1
RL  (via drill 0.51)
  Top 0.254: U3.13 27.92,44.43 25.65,42.16 v25.65,41.53 | v44.7,35.18 44.7,37.57 U2.5
  Bottom 0.254: v25.65,41.53 25.65,32.89 29.08,29.46 38.99,29.46 v44.7,35.18
RTS  (via drill 0.51)
  Top 0.254: U3.22 32,40.26 v31.11,39.37 | U2.10 34.67,35.94 32.26,33.53 31.37,33.53 30.48,34.42 30.48,35.31 v31.11,35.94
  Bottom 0.254: 31.11,36.2 31.11,36.07 | 31.11,36.2 v31.11,39.37 | v31.11,35.94 31.11,36.2
SCLK
  Top 0.254: U3.9 32,47.12 31.75,47.37 23.62,47.37 20.32,50.67 U1.D13
SENS1
  Top 0.254: JP1.1 47.94,14.42 45.21,17.14 43.94,17.14 42.55,18.54 42.6,18.6 U2.30
SENS2
  Top 0.254: JP2.1 50.8,14.48 49.66,15.62 48.01,15.62 45.03,18.6 U2.31
SENS3
  Top 0.254: JP3.1 52.51,14.42 51.44,15.49 50.93,15.49 50.04,16.38 48.9,16.38 U2.32 | U2.32 46.61,18.67 | U2.32
VIN
  Top 0.254: U1.VIN 36.83,3.05 28.96,10.92 28.96,12.6 U4.3 28.89,13.65 28.57,13.97 27.3,13.97 27.05,13.72 27.05,12.7 27.02,12.67 U4.1

### Text on the board
Bottom: 6/15/10
tPlace: WiFly Shield | PIO9 | PIO7 | PIO6 | PIO5 | PIO4 | SENSE1 | SENSE2 | SENSE3